# EAGLE design waterlevel (EAGLE 9.6.1)
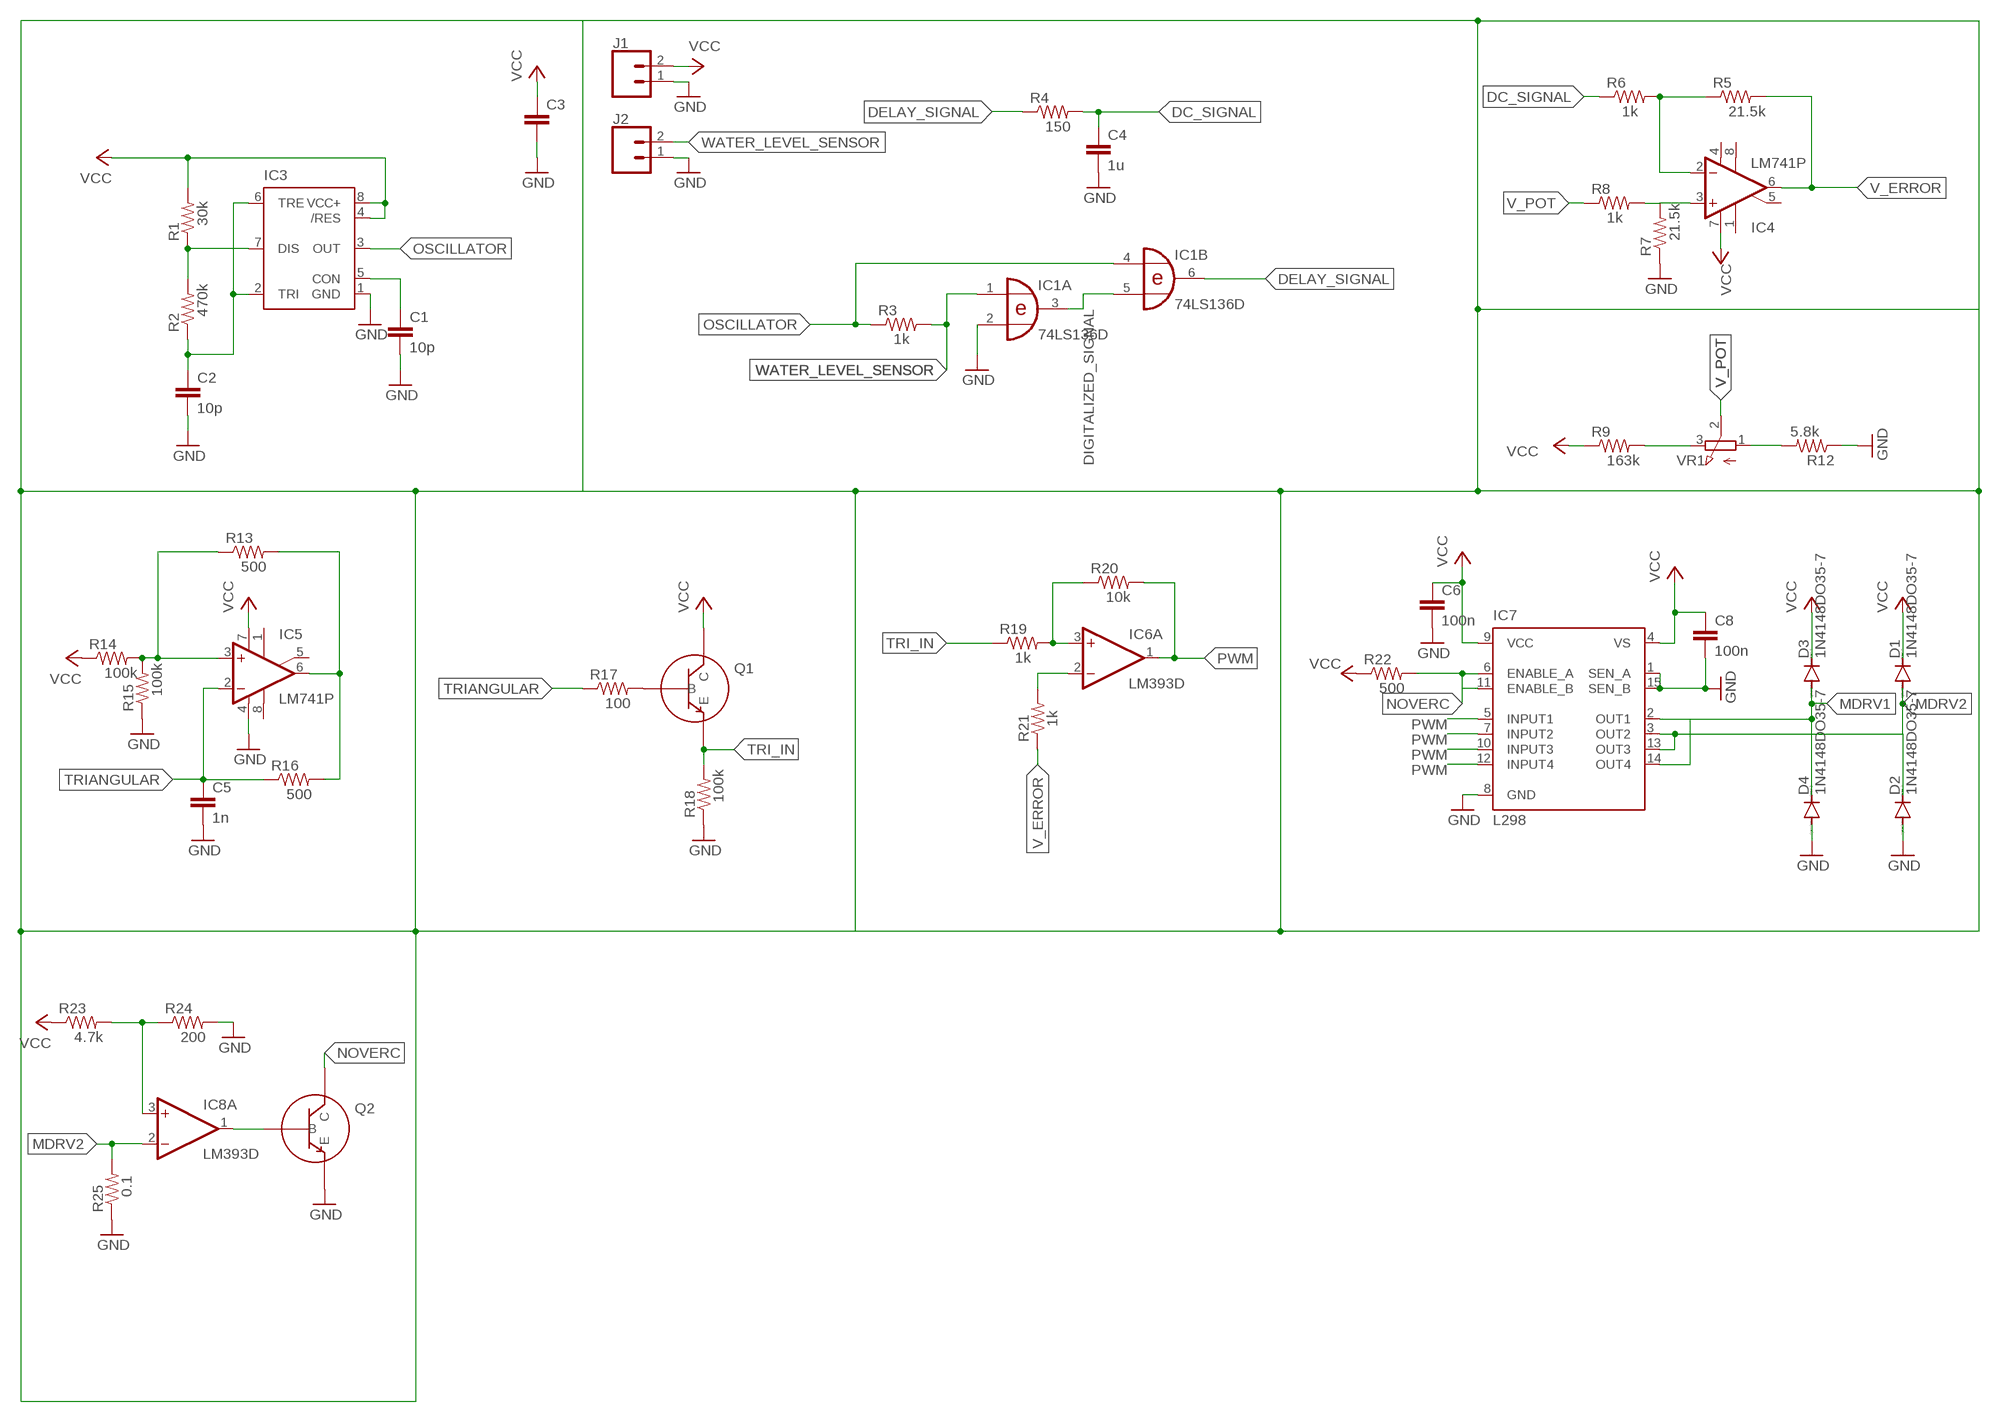
[diagram p0: schematic, sheet 1]

## Parts
C1  10p  C-EUC0603  [C0603]
C2  10p  C-EUC0603  [C0603]
C3  C-EUC0603  [C0603]
C4  1u  C-EUC0603  [C0603]
C5  1n  C-EUC0603  [C0603]
C6  100n  C-EUC0603  [C0603]
C8  100n  C-EUC0603  [C0603]
D1  1N4148DO35-7  [DO35-7]
D2  1N4148DO35-7  [DO35-7]
D3  1N4148DO35-7  [DO35-7]
D4  1N4148DO35-7  [DO35-7]
IC1  74LS136D  [DIL14]
IC3  555  555SOP8  [SO08]
IC4  LM741P  [DIL08]
IC5  LM741P  [DIL08]
IC6  LM393D  [SO08]
IC7  L298  [MULTIWATT-15]
IC8  LM393D  [SO08]
J1  CONN_022  [1X02]
J2  CONN_022  [1X02]
Q1  BJT_NPN  (no package)
Q2  BJT_NPN  (no package)
R1  30k  R-US_R0603  [R0603]
R2  470k  R-US_R0603  [R0603]
R3  1k  R-US_R0603  [R0603]
R4  150  R-US_R0603  [R0603]
R5  21.5k  R-US_R0603  [R0603]
R6  1k  R-US_R0603  [R0603]
R7  21.5k  R-US_R0603  [R0603]
R8  1k  R-US_R0603  [R0603]
R9  163k  R-US_R0603  [R0603]
R12  5.8k  R-US_R0603  [R0603]
R13  500  R-US_R0603  [R0603]
R14  100k  R-US_R0603  [R0603]
R15  100k  R-US_R0603  [R0603]
R16  500  R-US_R0603  [R0603]
R17  100  R-US_R0603  [R0603]
R18  100k  R-US_R0603  [R0603]
R19  1k  R-US_R0603  [R0603]
R20  10k  R-US_R0603  [R0603]
R21  1k  R-US_R0603  [R0603]
R22  500  R-US_R0603  [R0603]
R23  4.7k  R-US_R0603  [R0603]
R24  200  R-US_R0603  [R0603]
R25  0.1  R-US_R0603  [R0603]
VR1  10k  3RP/1610N  [3RP/1610N]

## Nets
DC_SIGNAL: C4.1 R4.2 R6.1
DELAY_SIGNAL: IC1.6(B:O) R4.1
DIGITALIZED_SIGNAL: IC1.3(A:O) IC1.5(B:I1)
GND: C1.2 C2.2 C3.2 C4.2 C5.2 C6.2 C8.2 D2.A D4.A IC1.2(A:I1) IC3.1(GND) IC5.4(V-) IC7.1(SEN_A) IC7.8(GND) IC7.15(SEN_B) J1.1 J2.1 Q2.E R7.1 R12.1 R15.1 R18.1 R24.2 R25.1
MDRV1: D3.A D4.C IC7.2(OUT1) IC7.14(OUT4)
MDRV2: D1.A D2.C IC7.3(OUT2) IC7.13(OUT3)
N$2: IC3.7(DIS) R1.1 R2.2
N$3: R9.2 VR1.3(E)
N$4: C1.1 IC3.5(CON)
N$5: C2.1 IC3.2(TRI) IC3.6(TRE) R2.1
N$6: IC4.2(-IN) R5.1 R6.2
N$7: IC4.3(+IN) R7.2 R8.2
N$8: IC5.6(OUT) R13.2 R16.2
N$9: IC5.3(+IN) R13.1 R14.2 R15.2
N$10: Q1.B R17.2
N$11: IC6.3(A:+IN) R19.2 R20.1
N$12: IC8.3(A:+IN) R23.2 R24.1
N$13: IC6.2(A:-IN) R21.2
N$14: IC8.2(A:-IN) R25.2
N$15: IC8.1(A:OUT) Q2.B
N$16: VR1.2(S)
NOVERC: IC7.6(ENABLE_A) IC7.11(ENABLE_B) Q2.C R22.2
OSCILLATOR: IC1.4(B:I0) IC3.3(OUT) R3.1
PWM: IC6.1(A:OUT) IC7.5(INPUT1) IC7.7(INPUT2) IC7.10(INPUT3) IC7.12(INPUT4) R20.2
TRI_IN: Q1.E R18.2 R19.1
TRIANGULAR: C5.1 IC5.2(-IN) R16.1 R17.1
V_ERROR: IC4.6(OUT) R5.2 R21.1
V_POT: R8.1 R12.2 VR1.1(A)
VCC: C3.1 C6.1 C8.1 D1.C D3.C IC3.4(/RES) IC3.8(VCC+) IC4.7(V+) IC5.7(V+) IC7.4(VS) IC7.9(VCC) J1.2 Q1.C R1.2 R9.1 R14.1 R22.1 R23.1
WATER_LEVEL_SENSOR: IC1.1(A:I0) J2.2 R3.2
Unconnected: IC1.8(C:O) IC1.9(C:I0) IC1.10(C:I1) IC1.11(D:O) IC1.12(D:I0) IC1.13(D:I1) IC4.1(ON1) IC4.5(ON2) IC4.8(OPT) IC5.1(ON1) IC5.5(ON2) IC5.8(OPT) IC6.5(B:+IN) IC6.6(B:-IN) IC6.7(B:OUT) IC8.5(B:+IN) IC8.6(B:-IN) IC8.7(B:OUT)

## Power pins joined to a net without a drawn wire
GND: IC1.7(P:GND)
V+: IC6.8(P:V+) IC8.8(P:V+)
V-: IC4.4(V-) IC6.4(P:V-) IC8.4(P:V-)
VCC: IC1.14(P:VCC)

## Library data of the parts
C1-C5 C8 = rcl:C-EU: CAPACITOR, European symbol; SPICEPREFIX: C
C6 = rcl:C-EU: CAPACITOR, European symbol; C: 100n; SPICEPREFIX: C
D1-D4 = diode:1N4148: DIODE high speed (Philips)
IC1 = 74xx-eu:74*136: Quad EXCLUSIVE-OR (XOR) gate, open collector
IC3 = SparkFun-IC-Special-Function:555: General purpose bipolar Timer Datasheet <http://www.sparkfun.com/datasheets/Components/General/ne555.pdf> SparkFun Products SparkFun SparkPunk Sequencer Kit <https://www.sparkfun.com/products/12707> (KIT-12707) Storefront Component: 555 Timer <https://www.sparkfun.com/products/9273> (COM-09273) Two parts valid for production: VFP: IC-11930 (M7555 PTH) VFP: IC-09173 (555 PTH) - Preferred
IC4 IC5 = linear:*741: OP AMP
IC6 IC8 = linear:LM393: COMPARATOR
IC7 = waterlevel:L298: DUAL FULL-BRIDGE DRIVER; MPN: L298N; OC_FARNELL: 1589425; OC_NEWARK: 32M1527
J1 J2 = SparkFun-Connectors:CONN_02: Multi connection point. Often used as Generic Header-pin footprint for 0.1 inch spaced/style header connections On any of the 0.1 inch spaced packages, you can populate with these: Break Away Headers - Straight <https://www.sparkfun.com/products/116> (PRT-00116) Break Away Male Headers - Right Angle <https://www.sparkfun.com/products/553> (PRT-00553) Female Headers <https://www.sparkfun.com/products/115> (PRT-00115) Break Away Headers - Machine Pin <https://www.sparkfun.com/products/117> (PRT-00117) Break Away Female Headers - Swiss Machine Pin <https://www.sparkfun.com/products/743> (PRT-00743) For SCREWTERMINALS and SPRING TERMINALS visit here: Screw Terimnals on SparkFun.com <https://www.sparkfun.com/search/results?term=Screw+Terminals> (5mm/3.5mm/2.54mm spacing) This device is also useful as a general connection point to wire up your design to another part of your project. Our various solder wires solder well into these plated through hole pads. Hook-Up Wire - Assortment (Stranded, 22 AWG) <https://www.sparkfun.com/products/11375> (PRT-11375) Hook-Up Wire - Assortment (Solid Core, 22 AWG) <https://www.sparkfun.com/products/11367> (PRT-11367) View the entire wire category on our website here <https://www.sparkfun.com/categories/141> Special notes: Molex polarized connector foot print use with: PRT-08233 with associated crimp pins and housings. 2.54_SCREWTERM for use with PRT-10571. 3.5mm Screw Terminal footprints for PRT-08084 5mm Screw Terminal footprints for use with PRT-08432
Q1 Q2 = ngspice-simulation:BJT_NPN: Bipolar NPN Transistor
R1-R9 R12-R25 = rcl:R-US_: RESISTOR, American symbol; SPICEPREFIX: R
VR1 = waterlevel:3RP/1610N: 16mm Potentiometer one level Source: http://www.alphapotentiometers.net/html/16mm_pot_2.html

## Board
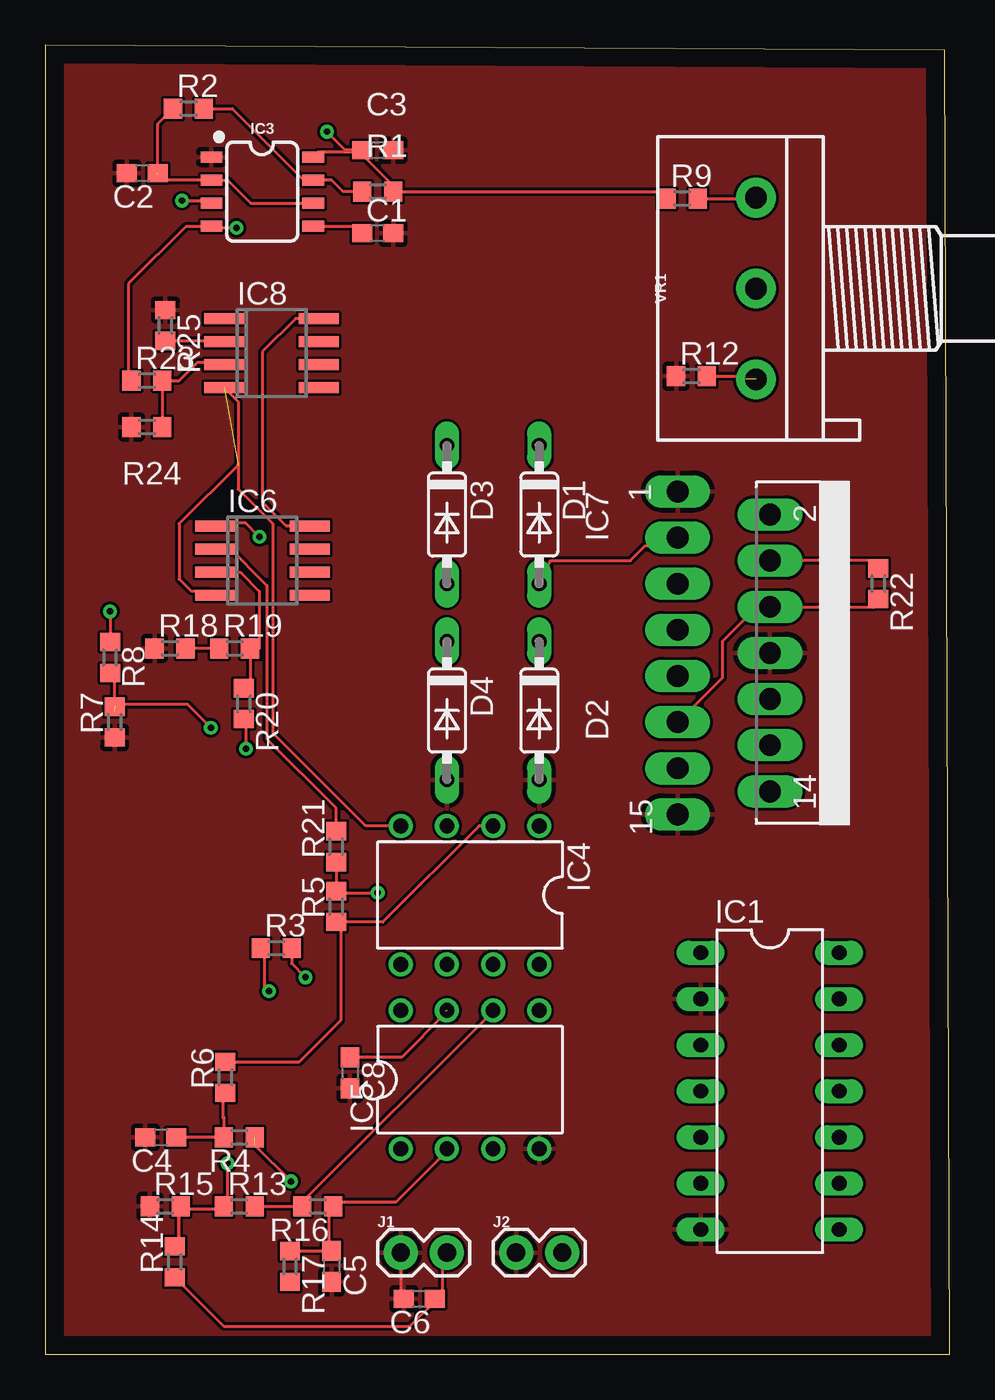
[diagram p1: board, top side]
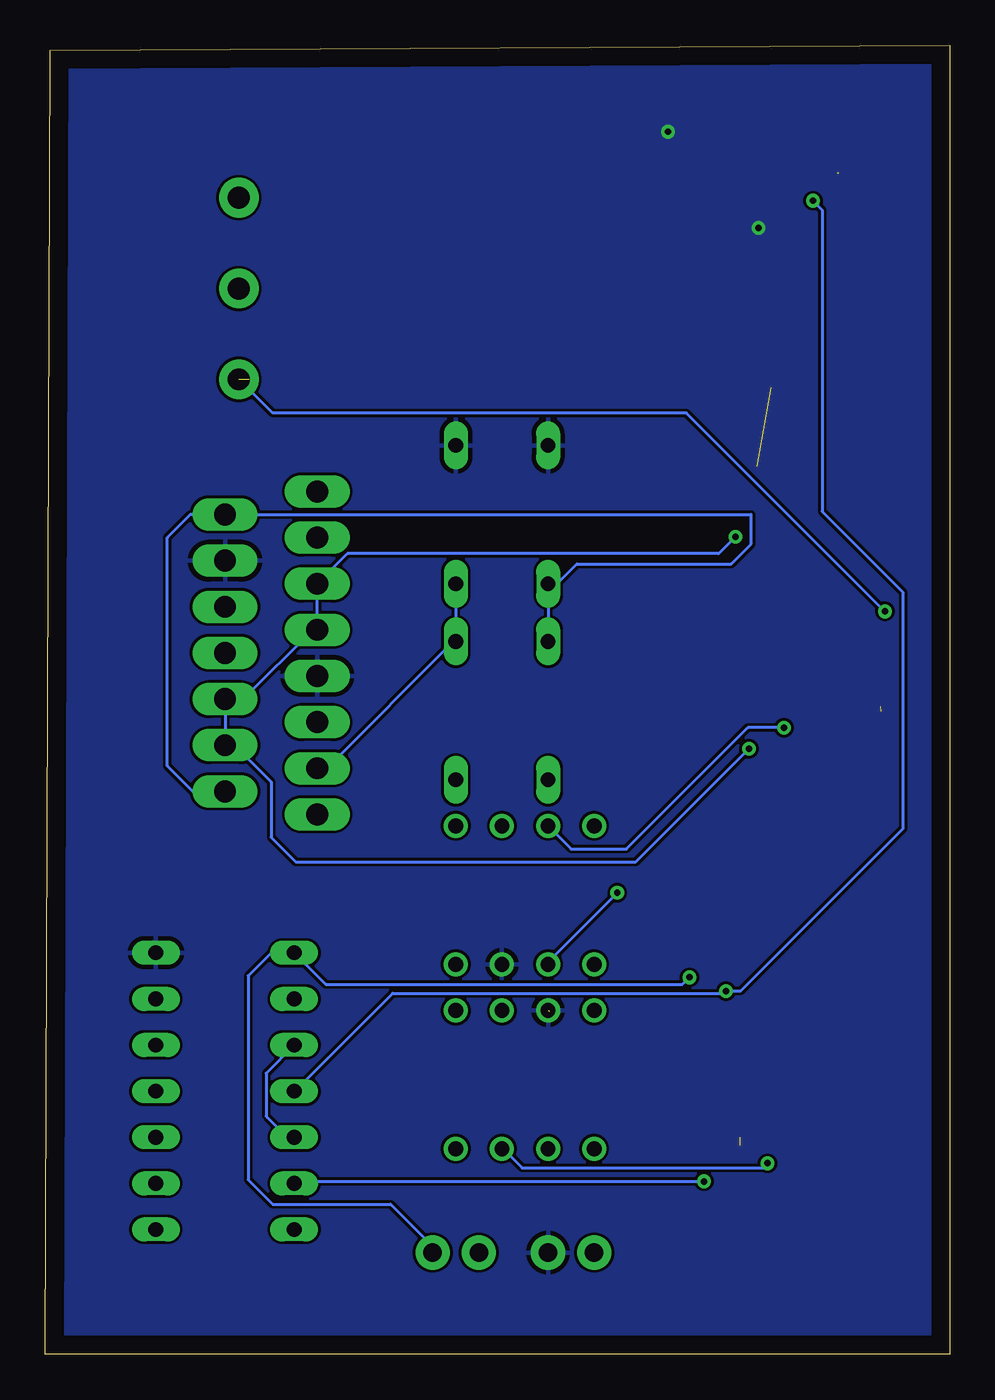
[diagram p2: board, bottom side, seen from below]

Size 49.76 x 72.06 mm. Coordinates in mm from the lower left corner, seen from the top.
Outline: 0,0 49.76,0 49.51,71.81 0,72.06 0,0
Copper layers (1*16): Top 0.035mm / dielectric 1.5mm / Bottom 0.035mm
Design rules "default": minimum track width 6mil, minimum drill 0.35mm, track to track 6mil, track to pad 6mil, pad to pad 6mil, via to via 6mil, smd to smd 6mil, copper to edge 40mil, drill to drill 6mil, minimum pad ring 10mil, minimum via ring 8mil, stop-mask expansion 4mil, vias tented up to drill 0mil, thermal gap 10mil

### Footprints (pad centres in the part's own frame; a part is rotated, then mirrored left to right if it is on the bottom)
C0603 = smd 1.1 x 1: 1 -0.85,0; 2 0.85,0
DO35-7 = drill 0.813 long: A 3.81,0; C -3.81,0
DIL14 = drill 0.813 long: 1 -7.62,-3.81; 2 -5.08,-3.81; 3 -2.54,-3.81; 4 0,-3.81; 5 2.54,-3.81; 6 5.08,-3.81; 7 7.62,-3.81; 8 7.62,3.81; 9 5.08,3.81; 10 2.54,3.81; 11 0,3.81; 12 -2.54,3.81; 13 -5.08,3.81; 14 -7.62,3.81
SO08 = smd 0.6 x 1.2: 1 -1.905,-2.8; 2 -0.635,-2.8; 3 0.635,-2.8; 4 1.905,-2.8; 5 1.905,2.8; 6 0.635,2.8; 7 -0.635,2.8; 8 -1.905,2.8
DIL08 = drill 0.813 pad 1.27: 1 -3.81,-3.81; 2 -1.27,-3.81; 3 1.27,-3.81; 4 3.81,-3.81; 5 3.81,3.81; 6 1.27,3.81; 7 -1.27,3.81; 8 -3.81,3.81
SO08' = smd 0.6 x 2.2: 1 -1.905,-2.6; 2 -0.635,-2.6; 3 0.635,-2.6; 4 1.905,-2.6; 5 1.905,2.6; 6 0.635,2.6; 7 -0.635,2.6; 8 -1.905,2.6
MULTIWATT-15 = drill 1.2 long: 1 -8.89,-7.62; 2 -7.62,-2.54; 3 -6.35,-7.62; 4 -5.08,-2.54; 5 -3.81,-7.62; 6 -2.54,-2.54; 7 -1.27,-7.62; 8 0,-2.54; 9 1.27,-7.62; 10 2.54,-2.54; 11 3.81,-7.62; 12 5.08,-2.54; 13 6.35,-7.62; 14 7.62,-2.54; 15 8.89,-7.62
1X02 = drill 1.016 pad 1.88: 1 0,0; 2 2.54,0
R0603 = smd 1 x 1.1: 1 -0.85,0; 2 0.85,0
3RP/1610N = drill 1.2 pad 2.184: 1 -5,0; 2 0,0; 3 5,0

### Placement (x,y rotation side)
C1  18.29,61.72 0 top
C2  5.33,65.02 180 top
C3  18.29,66.29 0 top
C4  6.35,11.94 180 top
C5  15.75,4.83 270 top
C6  20.57,3.05 180 top
C8  16.76,15.49 270 top
D1  27.18,46.23 270 top
D2  27.18,35.43 270 top
D3  22.1,46.23 270 top
D4  22.1,35.43 270 top
IC1  39.88,14.48 270 top
IC3  11.94,64.01 270 top
IC4  23.37,25.27 180 top
IC5  23.37,15.11 0 top
IC6  LM393D  [SO08']  11.94,43.69 270 top
IC7  42.42,38.61 270 top
IC8  LM393D  [SO08']  12.45,55.12 270 top
J1  19.56,5.59 0 top
J2  25.91,5.59 0 top
R1  18.29,64.01 0 top
R2  7.87,68.58 0 top
R3  12.7,22.35 0 top
R4  10.67,11.94 180 top
R5  16,24.64 90 top
R6  9.91,15.24 90 top
R7  3.81,34.8 90 top
R8  3.56,38.35 270 top
R9  35.05,63.63 0 top
R12  35.56,53.85 0 top
R13  10.67,8.13 0 top
R14  7.11,5.08 90 top
R15  6.6,8.13 0 top
R16  14.99,8.13 180 top
R17  13.46,4.83 270 top
R18  6.86,38.86 0 top
R19  10.41,38.86 0 top
R20  10.92,35.81 270 top
R21  16,27.94 90 top
R22  45.85,42.42 270 top
R23  5.59,53.59 0 top
R24  5.59,51.05 180 top
R25  6.6,56.64 270 top
VR1  39.12,58.67 90 top

### Tracks (layer width: path | path; a pad name or v marks a point on that pad's centre or on a via)
DC_SIGNAL
  Top 0.152: 7.59,12.01 7.36,11.97 | 7.36,11.97 C4.1 | 9.52,12.01 R4.2 9.65,11.94 | 9.65,11.94 7.39,11.94 7.36,11.97 | 9.65,11.94 9.82,12.1 9.82,13.04 9.78,13.01 9.78,14.26 R6.1
DELAY_SIGNAL  (via drill 0.35)  (1 unrouted)
  Top 0.152: v13.52,9.51 11.52,11.51
  Bottom 0.152: v13.52,9.51 36.02,9.51 IC1.6
DIGITALIZED_SIGNAL
  Bottom 0.152: IC1.5 36.52,12.01 37.53,13.02 37.62,13.11 37.62,15.47 IC1.3
GND
  Top 0.152: J1.1 19.56,3.21 C6.2
  pour Top: 0.51,71.63 49.28,71.63 49.28,0.25 0.51,0.25
MDRV1
  Bottom 0.152: D4.C D3.A 21.6,42.42 20.51,43.51 12.02,43.51 10.92,44.6 10.92,46.23 IC7.2 41.78,46.23 43.05,44.96 43.05,32.38 41.66,30.99 IC7.14
MDRV2
  Top 0.152: IC7.3 34.52,44.51 33.02,44.51 32.2,43.69 27.81,43.69 D1.A
  Bottom 0.152: D1.A D2.C 27.31,39.24 34.29,32.26 IC7.13
N$2
  Top 0.152: 14.52,64.51 IC3.7 | R1.1 16.39,64.01 15.75,64.64 IC3.7 | IC3.7 14.23,64.64 10.29,68.58 R2.2
N$3
  Top 0.152: R9.2 39.07,63.63 VR1.3
N$4
  Top 0.152: 14.52,62.01 IC3.5 17.06,62.1 C1.1
N$5  (1 unrouted)
  Top 0.152: 9.02,64.51 IC3.2 | 9.52,64.51 9.17,64.63 | 9.17,64.63 IC3.2 | 9.16,64.64 9.17,64.63 | IC3.2 10.03,64.64 11.3,63.37 IC3.6 | R2.1 6.18,67.74 C2.1 | IC3.2 6.48,64.64 6.1,65.02
N$6
  Top 0.152: 9.52,16.01 9.58,15.96 R6.2 13.97,16.09 16.26,18.38 16.26,23.53 R5.1 | IC4.2 | IC4.2 24.61,29.08 | 16.26,23.96 16.07,23.79 R5.1 | IC4.2 23.88,29.08 18.58,23.79 R5.1
N$7  (via drill 0.35)  (1 unrouted)
  Top 0.152: R8.2 3.79,37.27 3.79,35.37 | v9.11,34.49 7.84,35.76 3.83,35.76 3.83,35.63 R7.2
  Bottom 0.152: v9.11,34.49 11.1,34.49 17.78,27.81 20.83,27.81 IC4.3
N$8
  Top 0.152: R16.2 R13.2 13.9,8.13 24.7,18.93 24.69,18.92 IC5.6
N$9  (via drill 0.35)
  Top 0.152: R15.2 7.34,8.08 7.34,6.1 R14.2 7.34,6.08 7.34,8.01 9.52,8.01 | 9.52,8.01 R13.1 | v10.02,10.51 10.02,8.51 9.52,8.01
  Bottom 0.152: v10.02,10.51 10.27,10.25 23.52,10.25 24.54,11.28 IC5.3
N$11
  Top 0.152: R20.1 11.26,37.01 R19.2 11.77,38.86 11.77,41.99 10.71,43.05 IC6.3 9.52,43.01
N$12
  Top 0.152: 6.83,51.02 R24.1 R23.2 | R23.2 6.27,53.42 | R23.2 7.37,53.59 8.38,54.61 9.72,54.61 IC8.3
N$13
  Top 0.152: 15.72,28.98 15.9,28.79 R21.2 16,30.06 12.19,33.87 12.19,42.33 10.01,44.51 9.52,44.51 IC6.2
N$14
  Top 0.152: R25.2 9.14,55.79 9.17,55.82 9.17,55.75 IC8.2
NOVERC
  Top 0.152: IC7.11 35.02,35.01 37.27,37.26 37.27,39.26 39.16,41.15 IC7.6 45.62,41.15 R22.2
OSCILLATOR  (via drill 0.35)
  Top 0.152: v12.3,19.99 12.05,20.25 12.05,22.15 R3.1 | v7.52,63.51 9.02,63.51 IC3.3
  Bottom 0.152: IC1.4 36.02,14.51 30.65,19.87 12.42,19.87 v12.3,19.99 11.5,19.99 2.56,28.94 2.56,41.94 7.01,46.4 7.01,63 v7.52,63.51
PWM  (via drill 0.35)
  Top 0.152: v11.78,45 11.02,45.76 9.51,45.76 IC6.1 | R20.2 11.03,34.85 v11.03,33.33
  Bottom 0.152: v11.78,45 12.71,44.07 33.15,44.07 IC7.5 IC7.7 35.05,39.88 38.86,36.07 IC7.10 IC7.12 39.37,33.53 37.34,31.5 37.34,28.45 35.99,27.1 17.27,27.1 v11.03,33.33
TRI_IN
  Top 0.152: 9.32,38.57 R19.1 R18.2 7.6,38.64
TRIANGULAR
  Top 0.152: 15.64,8.13 R16.1 | R17.1 C5.1 15.58,5.84 15.58,7.87 R16.1 | R16.1 16.09,8.38 19.3,8.38 22.1,11.18 IC5.2
V+
  Top 0.152: IC8.8 13.78,57.02 11.95,55.19 11.95,46.91 13.27,45.59 IC6.8
V-  (1 unrouted)
  Top 0.152: IC6.4 9.02,42.01 8.03,42.01 7.37,42.67 7.37,45.72 10.61,48.96 10.61,48.9 | 9.53,53.28 IC8.4 10.61,52.45 10.61,47.63 12.52,45.72 12.52,34.2 17.63,29.08 IC4.4
V_ERROR  (via drill 0.35)
  Top 0.152: R5.2 16,25.35 | R21.1 R5.2 | 22.1,21.59 IC4.6 | R5.2 16.09,25.4 v18.29,25.4
  Bottom 0.152: v18.29,25.4 22.1,21.59 IC4.6
V_POT  (via drill 0.35)  (1 unrouted)
  Top 0.152: 36.3,53.44 R12.2 38.94,53.85 VR1.1 | v3.56,40.89 R8.1
  Bottom 0.152: 38.53,53.67 38.46,53.66 | v3.56,40.89 14.48,51.82 37.26,51.82 VR1.1
VCC  (via drill 0.35)  (1 unrouted)
  Top 0.152: C3.1 17.44,66.17 14.99,66.17 IC3.8 | v10.52,62.01 9.52,62.01 IC3.4 7.75,62.1 4.57,58.93 4.57,53.76 R23.1 4.51,53.98 | 33.96,63.87 R9.1 33.82,64.01 R1.2 19.14,64.34 17.44,66.04 C3.1 | D3.C 22.1,50.6 | 22.02,18.87 22.02,18.76 19.6,16.34 C8.1 | R22.1 45.43,43.69 IC7.4 | J1.2 21.84,5.33 21.84,2.96 21.71,2.82 C6.1 21.42,2.88 20.07,1.52 9.82,1.52 R14.1 | C3.1 16.51,66.29 v15.49,67.31
  Bottom 0.152: 22.02,6.01 J1.2
  pour Bottom: 0.51,71.88 0.51,0.25 49.28,0.25 49.28,71.88
WATER_LEVEL_SENSOR  (via drill 0.35)
  Top 0.152: v14.31,20.75 13.55,21.51 R3.2
  Bottom 0.152: v14.31,20.75 14.7,20.36 34.33,20.36 IC1.1 37.34,22.1 38.61,20.83 38.61,9.6 37.26,8.25 30.76,8.25 28.52,6.01 J2.2